# EAGLE design devaamo_myhalf (EAGLE 6.5.0)
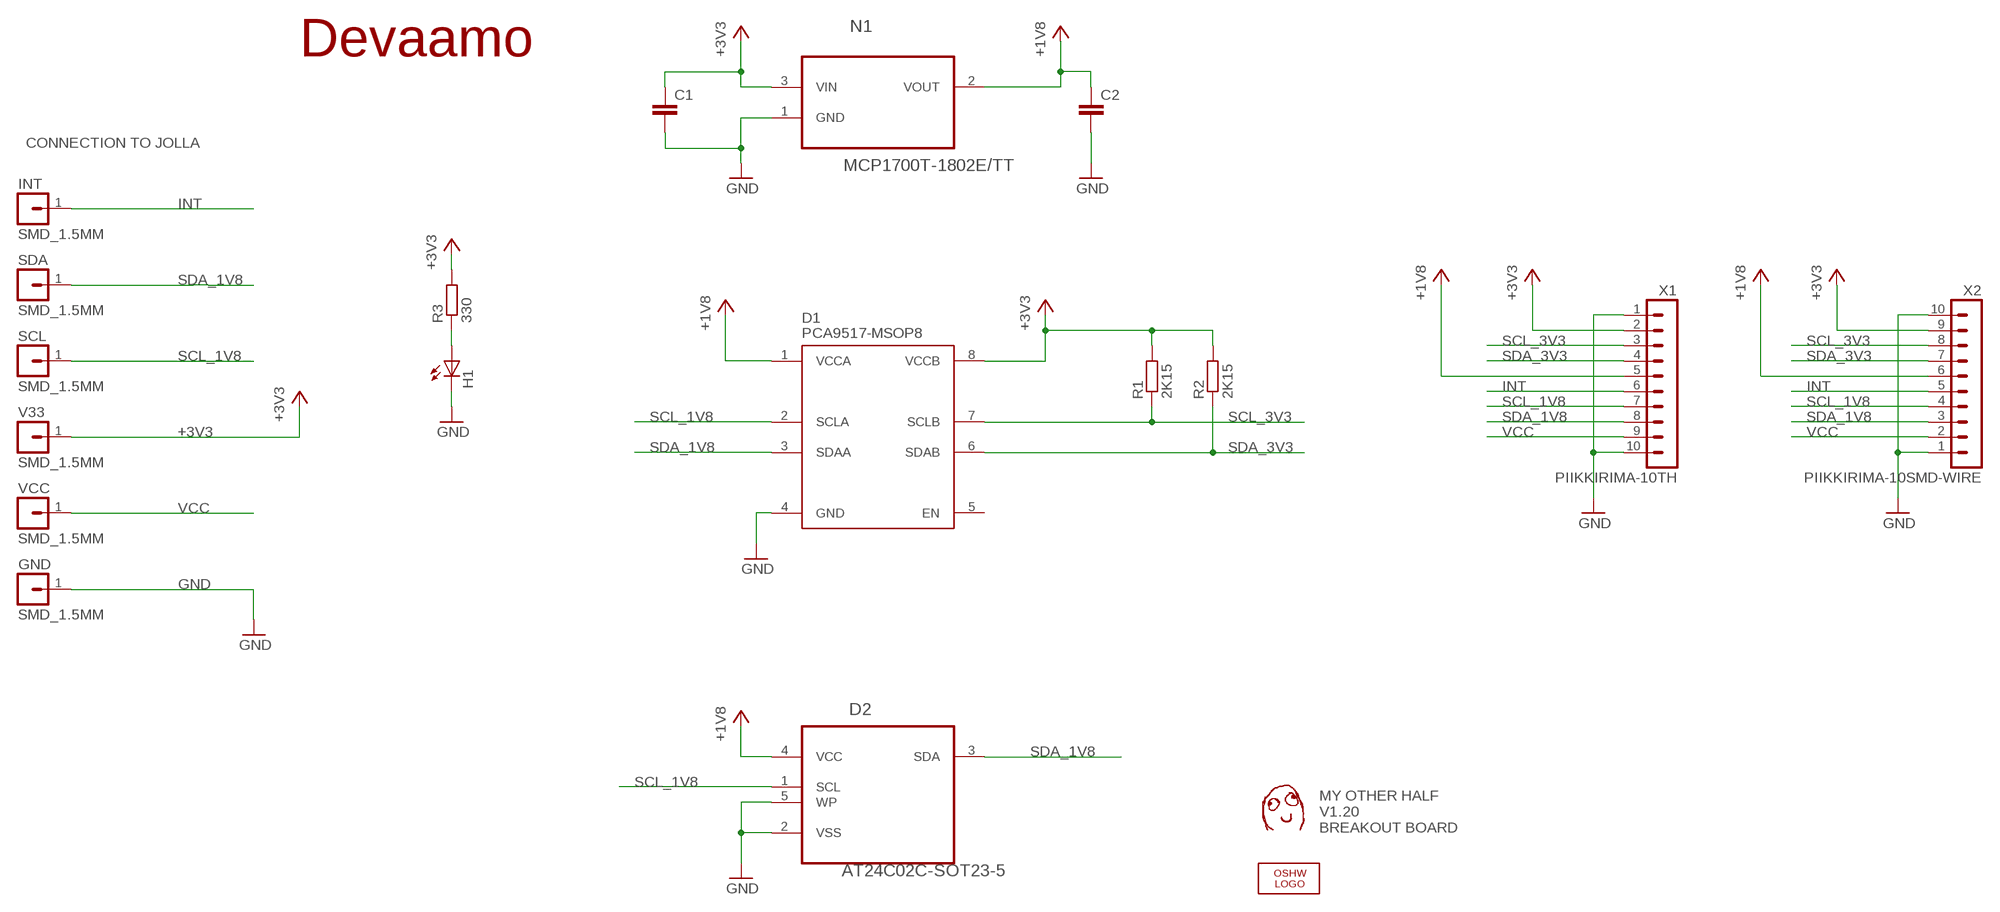
[diagram p0: schematic, sheet 1]

## Parts
C1  C-EUC0603  [C0603]
C2  C-EUC0603  [C0603]
D1  PCA9517-MSOP8  PCA9517  [SOP65P490X110-8N]
D2  AT24C02C-SOT23-5  24LC01BT-I/OT  [SOT95P280X145-5N]
GND  SMD_1.5MM  [SMD_ROUND_1.5MM]
H1  LEDCHIP-LED0603  [CHIP-LED0603]
INT  SMD_1.5MM  [SMD_ROUND_1.5MM]
LOGO1  OSHW_LOGO_FILLX0200-NT  [OSHW_FILLX200_NOTEXT]
N1  MCP1700T-1802E/TT  [SOT95P237X112-3N]
R1  2K15  R-EU_R0603  [R0603]
R2  2K15  R-EU_R0603  [R0603]
R3  330  R-EU_R0603  [R0603]
SCL  SMD_1.5MM  [SMD_ROUND_1.5MM]
SDA  SMD_1.5MM  [SMD_ROUND_1.5MM]
U$1  DAFUG  [DAFUG]
U$3  DEVAAMO  [DEVAAMO]
V33  SMD_1.5MM  [SMD_ROUND_1.5MM]
VCC  SMD_1.5MM  [SMD_ROUND_1.5MM]
X1  PIIKKIRIMA-10TH  [PIIKKIRIMA-10]
X2  PIIKKIRIMA-10SMD-WIRE  [61001018321]

## Nets
+1V8: C2.1 D1.1(VCCA) D2.4(VCC) N1.2(VOUT) X1.5 X2.6
+3V3: C1.1 D1.8(VCCB) N1.3(VIN) R1.2 R2.2 R3.2 V33.1 X1.2 X2.9
GND: C1.2 C2.2 D1.4(GND) D2.2(VSS) D2.5(WP) GND.1 H1.C N1.1(GND) X1.1 X1.10 X2.1 X2.10
INT: INT.1 X1.6 X2.5
N$2: H1.A R3.1
SCL_1V8: D1.2(SCLA) D2.1(SCL) SCL.1 X1.7 X2.4
SCL_3V3: D1.7(SCLB) R1.1 X1.3 X2.8
SDA_1V8: D1.3(SDAA) D2.3(SDA) SDA.1 X1.8 X2.3
SDA_3V3: D1.6(SDAB) R2.1 X1.4 X2.7
VCC: VCC.1 X1.9 X2.2
Unconnected: D1.5(EN)

## Notes on the sheet
- CONNECTION TO JOLLA
- MY OTHER HALF
  V1.20
  BREAKOUT BOARD

## Library data of the parts
C1 C2 = rcl:C-EU: CAPACITOR, European symbol
D1 = OMAT_IC:PCA9517
D2 = Microchip_By_element14_Batch_1:24LC01BT-I/OT: Serial EEPROM; MPN: 24LC01BT-I/OT; OC_FARNELL: 9757880; OC_NEWARK: 12C1993; PACKAGE: SOT23-5; SUPPLIER: MICROCHIP
GND INT SCL SDA V33 VCC = OMAT_IC:SMD_1.5MM
H1 = OMAT_IC:LED: LED OSRAM: - CHIPLED LG R971, LG N971, LY N971, LG Q971, LY Q971, LO R971, LY R971 LH N974, LH R974 LS Q976, LO Q976, LY Q976 LO Q996 - Hyper CHIPLED LW Q18S LB Q993, LB Q99A, LB R99A - SideLED LS A670, LO A670, LY A670, LG A670, LP A670 LB A673, LV A673, LT A673, LW A673 LH A674 LY A675 LS A676, LA A676, LO A676, LY A676, LW A676 LS A679, LY A679, LG A679 - Hyper Micro SIDELED® LS Y876, LA Y876, LO Y876, LY Y876 LT Y87S - SmartLED LW L88C, LW L88S LB L89C, LB L89S, LG L890 LS L89K, LO L89K, LY L89K LS L896, LA L896, LO L896, LY L896 - TOPLED LS T670, LO T670, LY T670, LG T670, LP T670 LSG T670, LSP T670, LSY T670, LOP T670, LYG T670 LG T671, LOG T671, LSG T671 LB T673, LV T673, LT T673, LW T673 LH T674 LS T676, LA T676, LO T676, LY T676, LB T676, LH T676, LSB T676, LW T676 LB T67C, LV T67C, LT T67C, LS T67K, LO T67K, LY T67K, LW E67C LS E67B, LA E67B, LO E67B, LY E67B, LB E67C, LV E67C, LT E67C LW T67C LS T679, LY T679, LG T679 LS T770, LO T770, LY T770, LG T770, LP T770 LB T773, LV T773, LT T773, LW T773 LH T774 LS E675, LA E675, LY E675, LS T675 LS T776, LA T776, LO T776, LY T776, LB T776 LHGB T686 LT T68C, LB T68C - Hyper Mini TOPLED® LB M676 - Mini TOPLED Santana® LG M470 LS M47K, LO M47K, LY M47K Source: http://www.osram.convergy.de LUXEON: - LUMILED® LXK2-PW12-R00, LXK2-PW12-S00, LXK2-PW14-U00, LXK2-PW14-V00 LXK2-PM12-R00, LXK2-PM12-S00, LXK2-PM14-U00 LXK2-PE12-Q00, LXK2-PE12-R00, LXK2-PE12-S00, LXK2-PE14-T00, LXK2-PE14-U00 LXK2-PB12-K00, LXK2-PB12-L00, LXK2-PB12-M00, LXK2-PB14-N00, LXK2-PB14-P00, LXK2-PB14-Q00 LXK2-PR12-L00, LXK2-PR12-M00, LXK2-PR14-Q00, LXK2-PR14-R00 LXK2-PD12-Q00, LXK2-PD12-R00, LXK2-PD12-S00 LXK2-PH12-R00, LXK2-PH12-S00 LXK2-PL12-P00, LXK2-PL12-Q00, LXK2-PL12-R00 Source: www.luxeon.com KINGBRIGHT: KA-3528ASYC Source: www.kingbright.com
LOGO1 = ohw-logo:OSHW_LOGO_FILL
N1 = Microchip_By_element14_Batch_1:MCP1700T-1802E/TT: Low Quiescent Current LDO; MPN: MCP1700T-1802E/TT; OC_FARNELL: 1296591; OC_NEWARK: 84R5175; PACKAGE: SOT23-3; SUPPLIER: Microchip
R1-R3 = rcl:R-EU_: RESISTOR, European symbol
U$1 = dafug:DAFUG
U$3 = oma:DEVAAMO
X1 X2 = OMAT_IC:PIIKKIRIMA-10

## Board
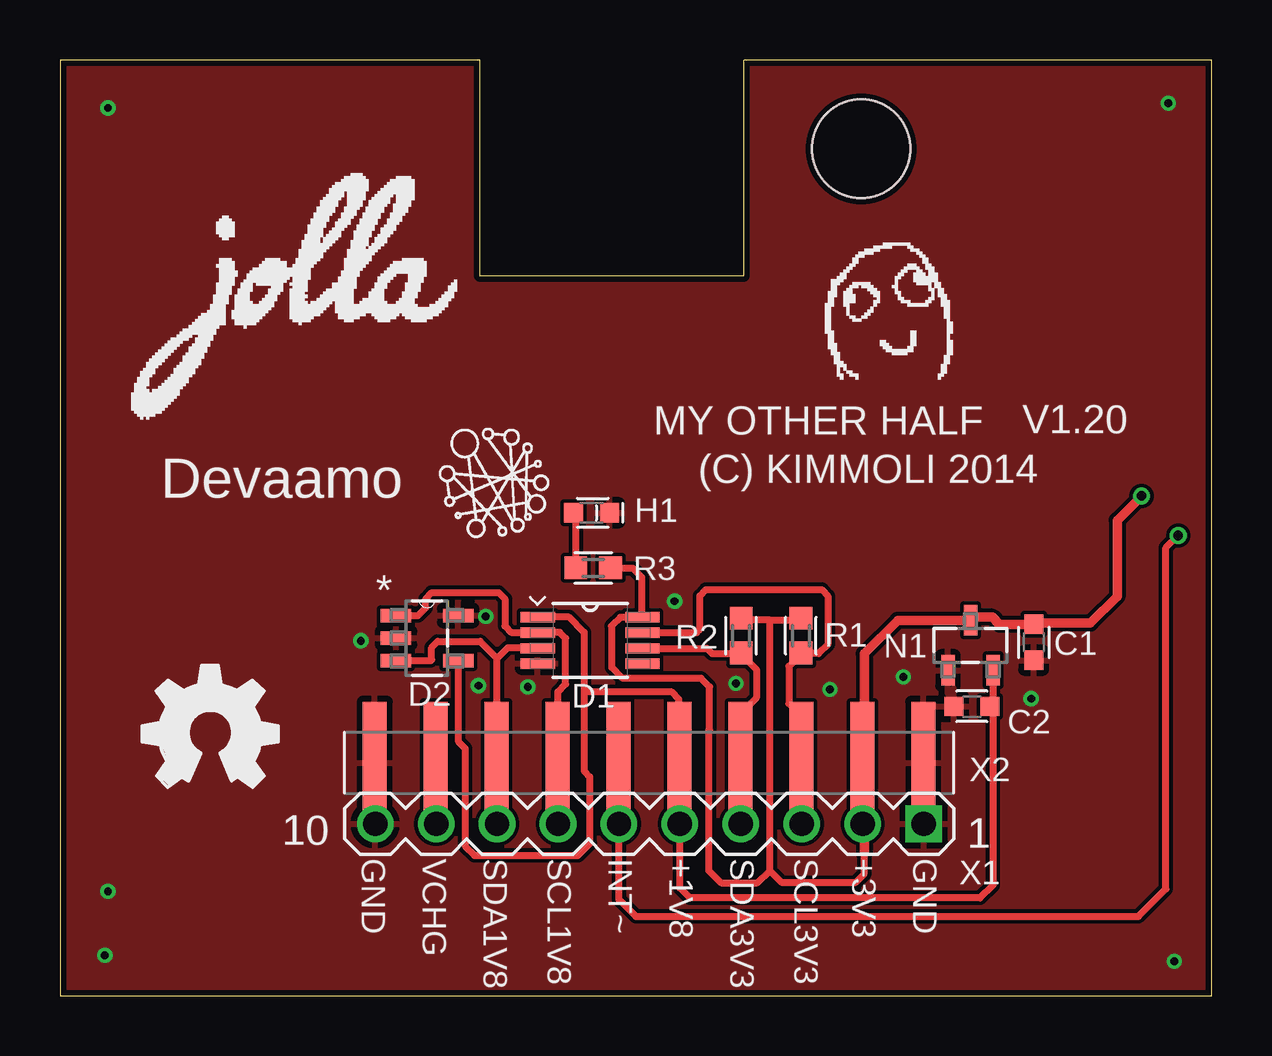
[diagram p1: board, top side]
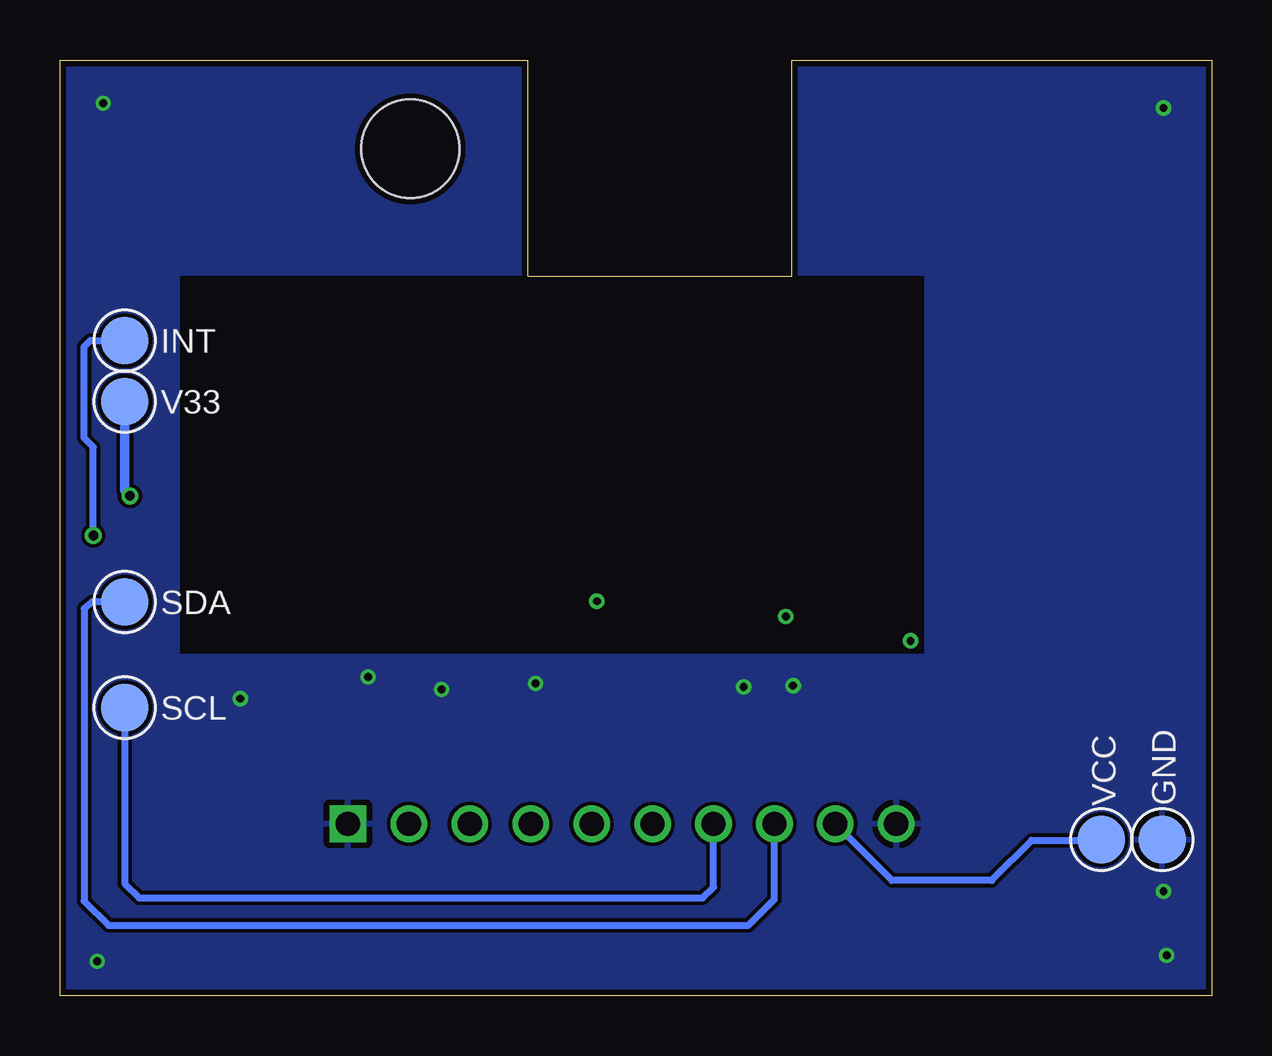
[diagram p2: board, bottom side, seen from below]

Size 48 x 39 mm. Coordinates in mm from the lower left corner, seen from the top.
Outline: 0,0 48,0 48,39 28.5,39 28.5,30 17.5,30 17.5,39 0,39 0,0
Copper layers (1*16): Top 0.035mm / dielectric 1.5mm / Bottom 0.035mm
Design rules "ITEADstudio_DRC": minimum track width 6mil, minimum drill 12mil, track to track 6mil, track to pad 6mil, pad to pad 6mil, via to via 6mil, smd to smd 0mil, copper to edge 10mil, drill to drill 10mil, minimum pad ring 10mil, minimum via ring 6mil, stop-mask expansion 2mil, vias tented up to drill 100mil, thermal gap 10mil
Holes 4.1 mm at 33.4,35.3

### Footprints (pad centres in the part's own frame; a part is rotated, then mirrored left to right if it is on the bottom)
C0603 = smd 0.8 x 0.8: 1 -0.75,0; 2 0.75,0
SOP65P490X110-8N = smd 1.422 x 0.432: 1 -2.184,0.965; 2 -2.184,0.33; 3 -2.184,-0.33; 4 -2.184,-0.965; 5 2.184,-0.965; 6 2.184,-0.33; 7 2.184,0.33; 8 2.184,0.965
SOT95P280X145-5N = smd 1.27 x 0.559: 1 -1.295,0.94; 2 -1.295,0; 3 -1.295,-0.94; 4 1.295,-0.94; 5 1.295,0.94
SMD_ROUND_1.5MM = smd 1.981 x 1.981: 1 0,0
CHIP-LED0603 = smd 0.8 x 0.8: A -0.75,0; C 0.75,0
SOT95P237X112-3N = smd 0.559 x 1.27: 1 -0.94,-1.041; 2 0.94,-1.041; 3 0,1.041
R0603 = smd 0.95 x 0.95: 1 -0.725,0; 2 0.725,0
PIIKKIRIMA-10 = drill 1.016 square: 1 0,0 | drill 1.016: 2 2.54,0; 3 5.08,0; 4 7.62,0; 5 10.16,0; 6 12.7,0; 7 15.24,0; 8 17.78,0; 9 20.32,0; 10 22.86,0
61001018321 = smd 1 x 5.08: 1 -11.43,0; 2 -8.89,0; 3 -6.35,0; 4 -3.81,0; 5 -1.27,0; 6 1.27,0; 7 3.81,0; 8 6.35,0; 9 8.89,0; 10 11.43,0

### Placement (x,y rotation side)
C1  40.59,14.73 270 top
C2  38.01,12.05 180 top
D1  22.1,14.8 0 top
D2  15.3,14.9 0 top
GND  2.06,6.5 0 bottom
H1  22.16,20.12 0 top
INT  45.3,27.3 0 bottom
LOGO1  3.42,8.68 0 top
N1  37.95,14.6 0 top
R1  30.88,15 90 top
R2  28.39,15 90 top
R3  22.23,17.83 0 top
SCL  45.3,12 0 bottom
SDA  45.3,16.4 0 bottom
U$1  34.74,28.28 0 top
U$2  [JOLLALOGO]  10.39,29.02 0 top
U$3  18.08,21.32 0 top
V33  45.3,24.76 0 bottom
VCC  4.6,6.5 0 bottom
X1  36,7.16 180 top
X2  24.55,9.7 0 top

### Tracks (layer width: path | path; a pad name or v marks a point on that pad's centre or on a via)
+1V8
  Top 0.3: N1.2 38.89,12.09 | 38.89,12.09 38.89,4.6 38.35,4.06 26.26,4.06 25.84,4.49 X1.5 25.82,7.18 X2.6 25.8,9.72 25.8,12.35 25.5,12.65 21.84,12.65 | D1.1 21.21,15.78 21.84,15.14 21.84,12.65 | C2.1 38.85,12.05 38.89,12.09 | 21.84,12.65 21.84,9.36 22.07,9.12 22.07,6.37 22.1,6.35 21.59,5.84 17.27,5.84 16.89,6.22 16.89,10.3 16.59,10.6 D2.4
+3V3  (via drill 0.4)
  Top 0.3: R3.2 22.97,17.81 23.88,17.81 24.26,17.43 24.26,15.9 24.28,15.88 D1.8 23.36,15.77 22.99,15.4 23,15.38 23,13.68 23.45,13.22 26.73,13.22 27.07,12.88 27.07,11.08 27.05,11.08 27.05,5.21 27.56,4.7 29.08,4.7 29.59,5.21 | 38.09,15.78 N1.3 | 40.63,15.52 C1.1 | 29.59,5.21 30.1,4.7 33.15,4.7 33.53,5.08 33.53,5.95 X1.2 33.44,7.18 X2.9 | 29.59,5.21 29.59,15.65 | 29.59,15.65 28.47,15.65 R2.2 | 29.59,15.65 30.81,15.65 R1.2
  Top 0.4: v45.09,20.83 44.07,19.81 44.07,16.64 42.95,15.53 40.63,15.53 C1.1 39.16,15.48 38.86,15.78 38.09,15.78 | N1.3 34.92,15.64 33.53,14.25 33.53,5.95
  Bottom 0.4: V33.1 45.3,21.04 v45.09,20.83
GND  (via drill 0.33)
  other vias: 46.2,37.2 2,37 1.87,1.68 46.45,1.42 40.48,12.37 19.5,12.87 12.54,14.79 35.16,13.28 28.18,13.01 17.75,15.8 17.44,12.92 2,4.34 25.62,16.44 32.1,12.76
  pour Bottom: 0,39 48,39 48,0 0,0
  pour Top: 0,39 48,39 48,0 0,0
INT  (via drill 0.4)
  Top 0.3: v46.61,19.18 46.1,18.67 46.1,4.45 44.96,3.3 24,3.3 23.3,4 X1.6 X2.5
  Bottom 0.3: INT.1 46.74,27.3 46.99,27.05 46.99,23.24 46.61,22.86 v46.61,19.18
N$1
  cutout Bottom (rank 2): 43,14.27 43,30 12,30 12,14.27
N$2
  Top 0.3: R3.1 21.5,20.02 H1.A
SCL_1V8
  Top 0.3: D2.1 14.92,15.84 15.24,16.16 15.24,16.54 15.49,16.79 18.29,16.79 18.54,16.54 18.54,15.4 18.8,15.14 19.91,15.14 D1.2 19.93,15.14 20.83,15.14 21.08,14.89 21.08,12.98 20.76,12.66 X1.7 X2.4
  Bottom 0.3: SCL.1 45.3,4.66 44.7,4.06 21.21,4.06 20.76,4.51 X1.7
SCL_3V3
  Top 0.3: D1.7 26.53,15.13 26.67,15.27 26.67,16.67 26.92,16.92 31.75,16.92 32,16.67 32,14.63 31.62,14.25 30.91,14.25 | 30.91,14.25 R1.1 | 30.91,14.25 30.38,13.72 30.38,12.18 30.9,11.65 X2.8 30.92,9.68 X1.3
SDA_1V8
  Top 0.3: 18.22,14.06 X1.8 X2.3 | 18.22,14.06 18.67,14.51 19.88,14.51 D1.3 | D2.3 15.46,13.96 15.49,14 15.49,14.51 15.75,14.76 17.52,14.76 18.22,14.06
  Bottom 0.3: SDA.1 46.66,16.41 46.99,16.13 46.99,3.94 45.97,2.92 19.3,2.92 18.22,4 X1.8
SDA_3V3
  Top 0.3: D1.6 26.96,14.47 27.18,14.25 28.37,14.25 | 28.37,14.25 R2.1 | 28.37,14.25 29.02,13.6 29.02,12.4 28.36,11.73 X2.7 28.38,9.68 X1.4
VCC
  Top 0.3: X1.9 15.66,7.18 X2.2
  Bottom 0.3: VCC.1 4.62,6.48 7.49,6.48 9.15,4.82 9.15,4.8 13.32,4.8 X1.9

### Text on the board
tPlace: MY OTHER HALF | V1.20 | Devaamo | (C) KIMMOLI 2014 | GND | VCHG | SDA1V8 | SCL1V8 | INT~ | +1V8 | SDA3V3 | SCL3V3 | +3V3 | GND